# EAGLE design RasPi-powerSys (EAGLE 8.4.0)
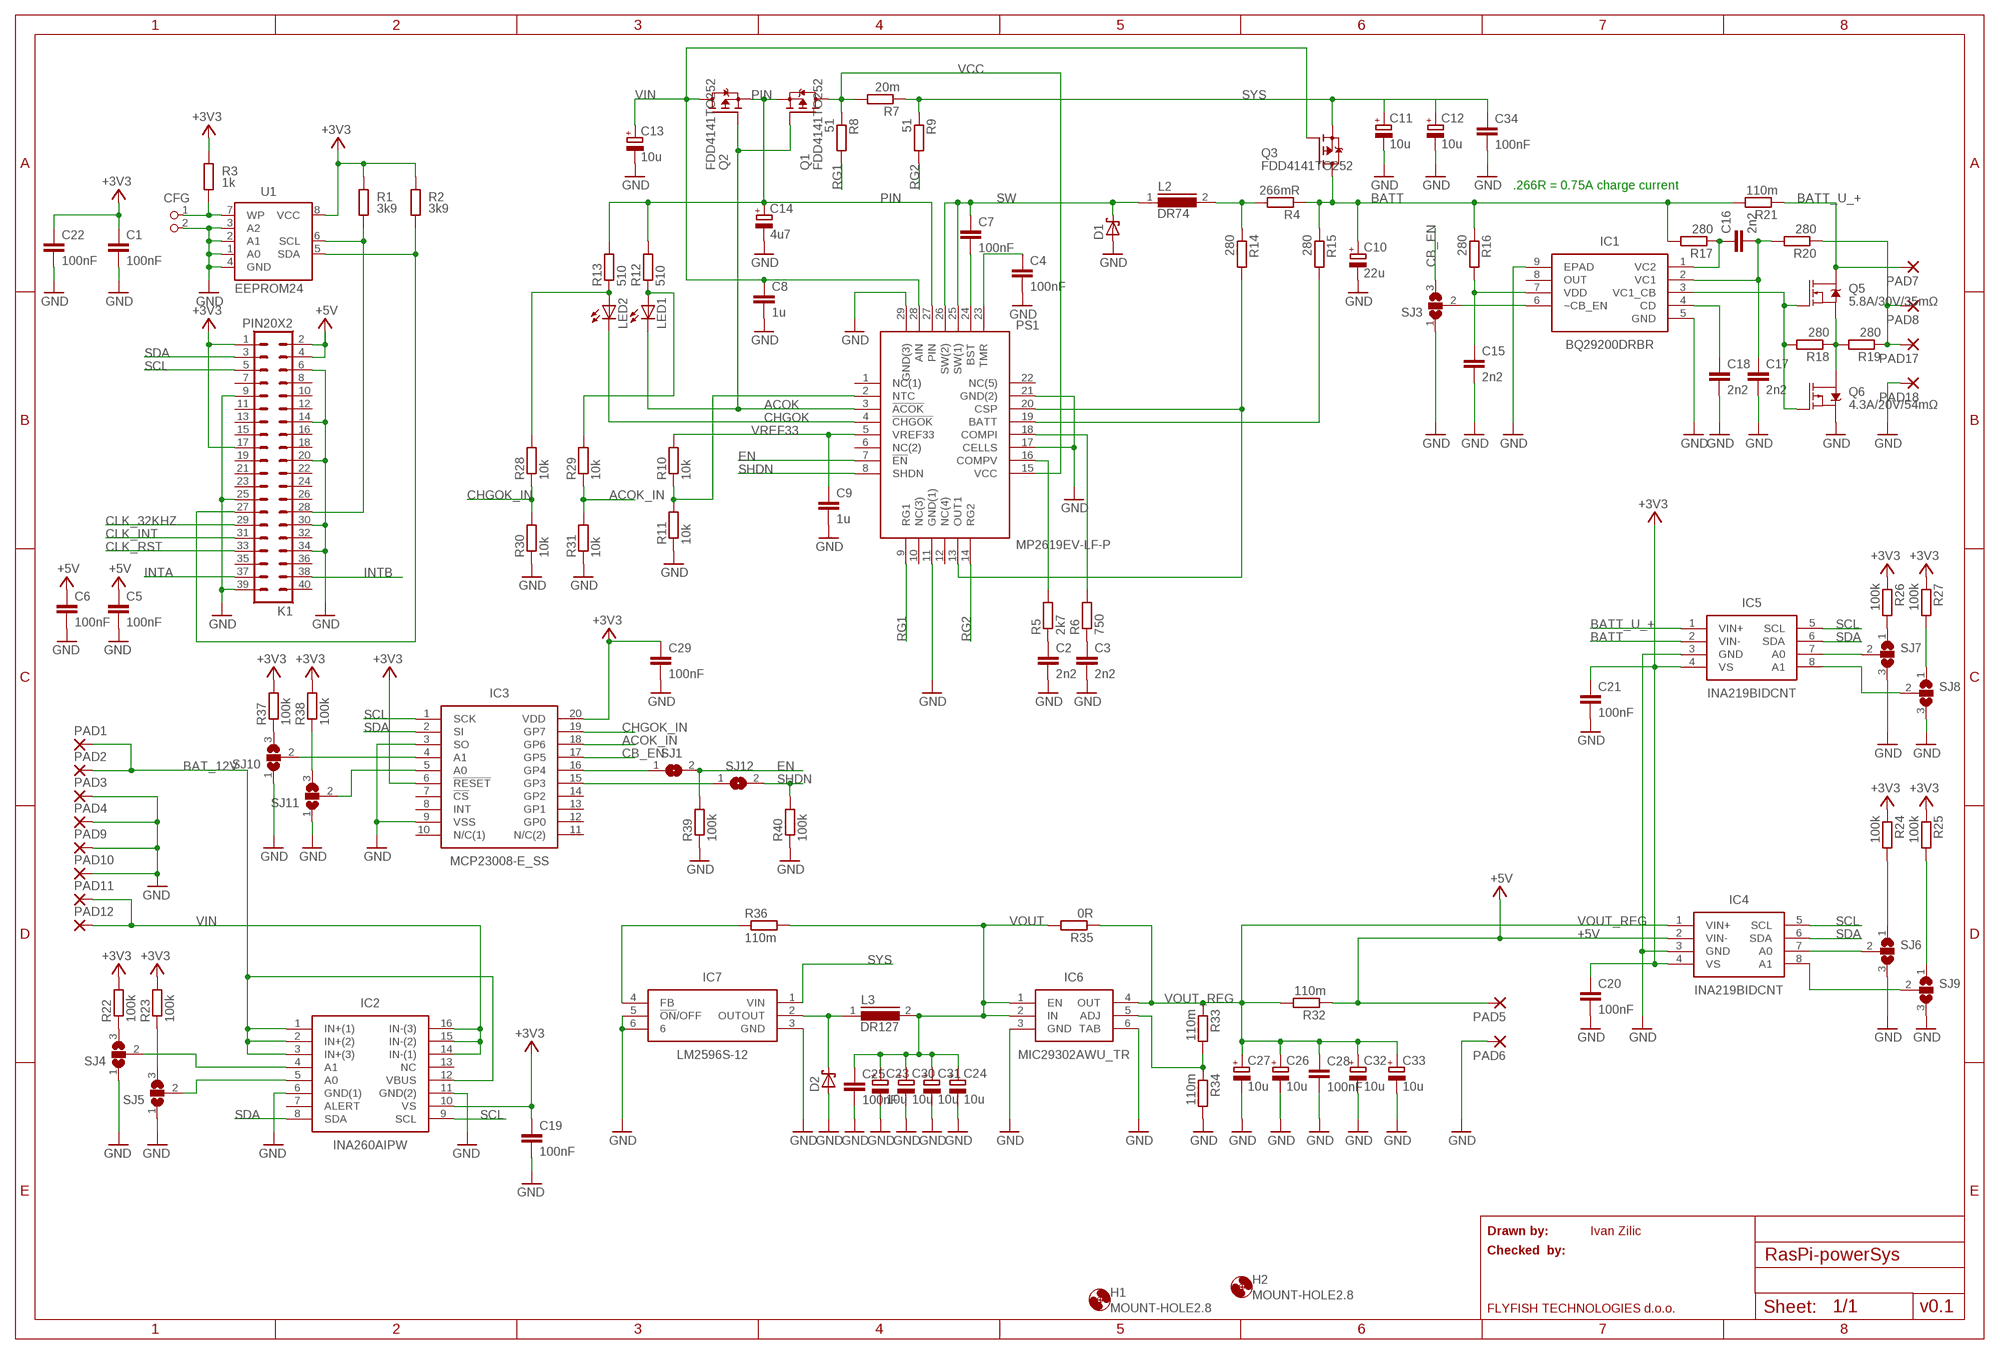
[diagram p0: schematic, sheet 1]

## Parts
C1  100nF  C-EUC0805K  [C0805K]
C2  2n2  C-EUC0805K  [C0805K]
C3  2n2  C-EUC0805K  [C0805K]
C4  100nF  C-EUC0805K  [C0805K]
C5  100nF  C-EUC0805K  [C0805K]
C6  100nF  C-EUC0805K  [C0805K]
C7  100nF  C-EUC0805K  [C0805K]
C8  1u  C-EUC0805K  [C0805K]
C9  1u  C-EUC0805K  [C0805K]
C10  22u  CPOL-EUSMCD  [SMC_D]
C11  10u  CPOL-EUSMCE  [SMC_E]
C12  10u  CPOL-EUSMCD  [SMC_D]
C13  10u  CPOL-EUSMCD  [SMC_D]
C14  4u7  CPOL-EUSMCD  [SMC_D]
C15  2n2  C-EUC0805K  [C0805K]
C16  2n2  C-EUC0805K  [C0805K]
C17  2n2  C-EUC0805K  [C0805K]
C18  2n2  C-EUC0805K  [C0805K]
C19  100nF  C-EUC0805K  [C0805K]
C20  100nF  C-EUC0805K  [C0805K]
C21  100nF  C-EUC0805K  [C0805K]
C22  100nF  C-EUC0805K  [C0805K]
C23  10u  CPOL-EUSMCE  [SMC_E]
C24  10u  CPOL-EUSMCE  [SMC_E]
C25  100nF  C-EUC0805K  [C0805K]
C26  10u  CPOL-EUSMCE  [SMC_E]
C27  10u  CPOL-EUSMCE  [SMC_E]
C28  100nF  C-EUC0805K  [C0805K]
C29  100nF  C-EUC0805K  [C0805K]
C30  10u  CPOL-EUSMCE  [SMC_E]
C31  10u  CPOL-EUSMCE  [SMC_E]
C32  10u  CPOL-EUSMCE  [SMC_E]
C33  10u  CPOL-EUSMCE  [SMC_E]
C34  100nF  C-EUC0805K  [C0805K]
CFG  PIN2_100  [PIN_W_2]
D1  SCHOTTKY-DIODESMD  [SMB]
D2  SCHOTTKY-DIODESMD  [SMB]
H1  MOUNT-HOLE2.8  [2,8]
H2  MOUNT-HOLE2.8  [2,8]
IC1  BQ29200DRBR  [SON65P300X300X100-9N]
IC2  INA260AIPW  [SOP65P640X120-16N]
IC3  MCP23008-E_SS  [SOP65P780X200-20N]
IC4  INA219BIDCNT  [SOT65P280X145-8N]
IC5  INA219BIDCNT  [SOT65P280X145-8N]
IC6  MIC29302AWU_TR  [5-PIN-TO-263(U)]
IC7  LM2596S-12  [5-PIN-TO-263(U)]
K1  PIN20X2  [PIN_20X2]
L2  DR74  [DR74]
L3  DR127  [DR127]
LED1  LEDCHIPLED_0805  [CHIPLED_0805]
LED2  LEDCHIPLED_0805  [CHIPLED_0805]
PAD1  3,81/1,4  [3,81/1,4]
PAD2  3,81/1,4  [3,81/1,4]
PAD3  3,81/1,4  [3,81/1,4]
PAD4  3,81/1,4  [3,81/1,4]
PAD5  3,81/1,4  [3,81/1,4]
PAD6  3,81/1,4  [3,81/1,4]
PAD7  3,81/1,4  [3,81/1,4]
PAD8  3,81/1,4  [3,81/1,4]
PAD9  3,81/1,4  [3,81/1,4]
PAD10  3,81/1,4  [3,81/1,4]
PAD11  3,81/1,4  [3,81/1,4]
PAD12  3,81/1,4  [3,81/1,4]
PAD17  3,81/1,4  [3,81/1,4]
PAD18  3,81/1,4  [3,81/1,4]
PS1  MP2619EV-LF-P  [QFN50P400X500X100-29N]
Q1  FDD4141TO252  [TO252]
Q2  FDD4141TO252  [TO252]
Q3  FDD4141TO252  [TO252]
Q5  5.8A/30V/35mΩ  MOSFET-NCH-AO3404A  [SOT23-3]
Q6  4.3A/20V/54mΩ  MOSFET_PCH-IRLML2244  [SOT23-3]
R1  3k9  R-EU_M0805  [M0805]
R2  3k9  R-EU_M0805  [M0805]
R3  1k  R-EU_M0805  [M0805]
R4  266mR  R-EU_R1206  [R1206]
R5  2k7  R-EU_R0805  [R0805]
R6  750  R-EU_R0805  [R0805]
R7  20m  R-EU_R0805  [R0805]
R8  51  R-EU_R0805  [R0805]
R9  51  R-EU_R0805  [R0805]
R10  10k  R-EU_R0805  [R0805]
R11  10k  R-EU_R0805  [R0805]
R12  510  R-EU_R0805  [R0805]
R13  510  R-EU_R0805  [R0805]
R14  280  R-EU_R0805  [R0805]
R15  280  R-EU_R0805  [R0805]
R16  280  R-EU_R0805  [R0805]
R17  280  R-EU_R1206  [R1206]
R18  280  R-EU_R1206  [R1206]
R19  280  R-EU_R1206  [R1206]
R20  280  R-EU_R1206  [R1206]
R21  110m  R-EU_R0805  [R0805]
R22  100k  R-EU_R0805  [R0805]
R23  100k  R-EU_R0805  [R0805]
R24  100k  R-EU_R0805  [R0805]
R25  100k  R-EU_R0805  [R0805]
R26  100k  R-EU_R0805  [R0805]
R27  100k  R-EU_R0805  [R0805]
R28  10k  R-EU_R0805  [R0805]
R29  10k  R-EU_R0805  [R0805]
R30  10k  R-EU_R0805  [R0805]
R31  10k  R-EU_R0805  [R0805]
R32  110m  R-EU_R1206  [R1206]
R33  110m  R-EU_R0805  [R0805]
R34  110m  R-EU_R0805  [R0805]
R35  0R  R-EU_R1206  [R1206]
R36  110m  R-EU_R0805  [R0805]
R37  100k  R-EU_R0805  [R0805]
R38  100k  R-EU_R0805  [R0805]
R39  100k  R-EU_R0805  [R0805]
R40  100k  R-EU_R0805  [R0805]
SJ1  SJ  [SJ]
SJ3  SJ2W  [SJ_2]
SJ4  SJ2W  [SJ_2]
SJ5  SJ2W  [SJ_2]
SJ6  SJ2W  [SJ_2]
SJ7  SJ2W  [SJ_2]
SJ8  SJ2W  [SJ_2]
SJ9  SJ2W  [SJ_2]
SJ10  SJ2W  [SJ_2]
SJ11  SJ2W  [SJ_2]
SJ12  SJ  [SJ]
U1  EEPROM24  [SOIC8]

## Nets
+3V3: C1.1 C19.1 C20.1 C21.1 C22.1 C29.1 IC2.10(VS) IC3.6(!RESET) IC3.20(VDD) IC4.4(VS) IC5.4(VS) K1.1 K1.17 R1.2 R2.2 R3.2 R22.2 R23.2 R24.1 R25.1 R26.1 R27.1 R37.2 R38.2 U1.8(VCC)
+5V: C5.1 C6.1 IC4.2(VIN-) K1.2 K1.4 PAD5.1(P) R32.1
ACOK: LED1.C PS1.3(!ACOK) Q1.1(G) Q2.1(G)
ACOK_IN: IC3.18(GP6) R29.1 R31.2
ADJ: IC6.5(ADJ) R33.2 R34.1
BAT_12V: IC2.1(IN+(1)) IC2.2(IN+(2)) IC2.3(IN+(3)) IC2.12(VBUS) PAD1.1(P) PAD2.1(P)
BATT: C10.+ IC5.2(VIN-) Q3.3(D) R4.1 R15.1 R16.1 R17.2 R21.2
BATT_U_+: IC5.1(VIN+) PAD7.1(P) Q5.3(D) R21.1
CB_EN: IC3.17(GP5) SJ3.3
CHGOK: LED2.C PS1.4(!CHGOK)
CHGOK_IN: IC3.19(GP7) R28.1 R30.2
CLK_32KHZ: K1.29
CLK_INT: K1.31
CLK_RST: K1.33
EN: PS1.7(!EN) R39.2 SJ1.2
GND: C1.2 C2.2 C3.2 C4.2 C5.2 C6.2 C8.2 C9.2 C10.- C11.- C12.- C13.- C14.- C15.2 C17.2 C18.2 C19.2 C20.2 C21.2 C22.2 C23.- C24.- C25.2 C26.- C27.- C28.2 C29.2 C30.- C31.- C32.- C33.- C34.2 CFG.2 D1.A D2.A IC1.5(GND) IC1.9(EPAD) IC2.6(GND(1)) IC2.11(GND(2)) IC3.3(SO) IC3.9(VSS) IC4.3(GND) IC5.3(GND) IC6.3(GND) IC6.6(TAB) IC7.3(GND) IC7.5(!ON!/OFF) IC7.6 K1.6 K1.9 K1.14 K1.20 K1.25 K1.30 K1.34 K1.39 PAD3.1(P) PAD4.1(P) PAD6.1(P) PAD9.1(P) PAD10.1(P) PAD18.1(P) PS1.11(GND(1)) PS1.17(CELLS) PS1.21(GND(2)) PS1.29(GND(3)) Q6.2(S) R11.1 R30.1 R31.1 R34.2 R39.1 R40.1 SJ3.1 SJ4.1 SJ5.1 SJ6.3 SJ7.3 SJ8.3 SJ9.3 SJ10.1 SJ11.1 U1.1(A0) U1.2(A1) U1.3(A2) U1.4(GND)
INTA: K1.37
INTB: K1.38
N$1: PS1.16(COMPV) R5.2
N$2: PS1.18(COMPI) R6.2
N$3: CFG.1 R3.1 U1.7(WP)
N$4: C2.1 R5.1
N$5: C3.1 R6.1
N$6: C4.1 PS1.23(TMR)
N$7: IC3.16(GP4) SJ1.1
N$8: C15.1 IC1.7(VDD) R16.2
N$9: C7.2 PS1.24(BST)
N$10: L2.2 R4.2 R14.1
N$11: IC1.6(~CB_EN) SJ3.2
N$12: PS1.2(NTC) R10.1 R11.2
N$13: Q5.2(S) Q6.3(D) R18.1 R19.2
N$14: IC3.15(GP3) SJ12.1
N$15: PS1.19(BATT) R15.2
N$16: LED1.A R12.1 R29.2
N$17: K1.28 R1.1 U1.6(SCL)
N$18: LED2.A R13.1 R28.2
N$19: C18.1 IC1.4(CD)
N$20: PS1.13(OUT1) PS1.20(CSP) R14.2
N$21: PAD8.1(P) PAD17.1(P) R19.1 R20.1
N$22: C16.2 C17.1 IC1.2(VC1) R20.2
N$23: K1.27 R2.1 U1.5(SDA)
N$24: C16.1 IC1.1(VC2) R17.1
N$25: IC1.3(VC1_CB) Q5.1(G) Q6.1(G) R18.2
N$26: IC2.5(A0) SJ5.2
N$27: IC2.4(A1) SJ4.2
N$28: R22.1 SJ4.3
N$29: R23.1 SJ5.3
N$30: R26.2 SJ7.1
N$31: R27.2 SJ8.1
N$32: IC4.8(A1) SJ9.2
N$33: IC4.7(A0) SJ6.2
N$34: IC5.8(A1) SJ8.2
N$35: IC5.7(A0) SJ7.2
N$36: R37.1 SJ10.3
N$37: D2.C IC7.2(OUTOUT) L3.1
N$38: R24.2 SJ6.1
N$39: R25.2 SJ9.1
N$41: IC7.4(FB) R36.1
N$42: IC3.4(A1) SJ10.2
N$43: IC3.5(A0) SJ11.2
N$44: R38.1 SJ11.3
PIN: C14.+ PS1.27(PIN) Q1.2(S) Q2.2(S) R12.2 R13.2
RG1: PS1.9(RG1) R8.2
RG2: PS1.14(RG2) R9.2
SCL: IC2.9(SCL) IC3.1(SCK) IC4.5(SCL) IC5.5(SCL) K1.5
SDA: IC2.8(SDA) IC3.2(SI) IC4.6(SDA) IC5.6(SDA) K1.3
SHDN: PS1.8(SHDN) R40.2 SJ12.2
SW: C7.1 D1.C L2.1 PS1.25(SW(1)) PS1.26(SW(2))
SYS: C11.+ C12.+ C34.1 IC7.1(VIN) Q3.2(S) R7.1 R9.1
VCC: PS1.15(VCC) Q1.3(D) R7.2 R8.1
VIN: C8.1 C13.+ IC2.14(IN-(1)) IC2.15(IN-(2)) IC2.16(IN-(3)) PAD11.1(P) PAD12.1(P) PS1.28(AIN) Q2.3(D) Q3.1(G)
VOUT: C23.+ C24.+ C25.1 C30.+ C31.+ IC6.1(EN) IC6.2(IN) L3.2 R35.2 R36.2
VOUT_REG: C26.+ C27.+ C28.1 C32.+ C33.+ IC4.1(VIN+) IC6.4(OUT) R32.2 R33.1 R35.1
VREF33: C9.1 PS1.5(VREF33) R10.2
Unconnected: IC1.8(OUT) IC2.7(ALERT) IC2.13(NC) IC3.7(!CS) IC3.8(INT) IC3.10(N/C(1)) IC3.11(N/C(2)) IC3.12(GP0) IC3.13(GP1) IC3.14(GP2) K1.7 K1.8 K1.10 K1.11 K1.12 K1.13 K1.15 K1.16 K1.18 K1.19 K1.21 K1.22 K1.23 K1.24 K1.26 K1.32 K1.35 K1.36 K1.40 PS1.1(NC(1)) PS1.6(NC(2)) PS1.10(NC(3)) PS1.12(NC(4)) PS1.22(NC(5))

## Notes on the sheet
- .266R = 0.75A charge current
- Drawn by: | Ivan Zilic
- Checked  by:
- FLYFISH TECHNOLOGIES d.o.o. | v0.1

## Library data of the parts
C1-C9 C15-C22 C25 C28 C29 C34 = resistor:C-EU: CAPACITOR, European symbol; DIELECTRIC: X7R
C10-C14 C23 C24 C26 C27 C30-C33 = rcl:CPOL-EU: POLARIZED CAPACITOR, European symbol
CFG = FLYFISH:PIN2
D1 D2 = diode:SCHOTTKY-DIODE: Schottky Diode
H1 H2 = holes:MOUNT-HOLE: MOUNTING HOLE with drill center marker
IC1 = SamacSys_Parts:BQ29200DRBR: Voltage Protection with Automatic Cell Balance For 2-Cell Li-Ion Batteries, OVP=4.35V <https://componentsearchengine.com/Images/1/BQ29200DRBR.jpg> Source: Datasheet <http://www.ti.com/lit/gpn/bq29200>; DESCRIPTION: Voltage Protection with Automatic Cell Balance For 2-Cell Li-Ion Batteries, OVP=4.35V; HEIGHT: mm; MANUFACTURER_NAME: Texas Instruments; MANUFACTURER_PART_NUMBER: BQ29200DRBR; SUPPLIER_NAME: RS
IC2 = SamacSys_Parts:INA260AIPW: High/Low-Side Digital Current/Power Monitor with Integrated 2m Shunt Resistor <https://componentsearchengine.com/Images/1/INA260AIPW.jpg> Source: Datasheet <http://www.ti.com/lit/gpn/ina260>; DESCRIPTION: High/Low-Side Digital Current/Power Monitor with Integrated 2m Shunt Resistor; HEIGHT: 1.2mm; MANUFACTURER_NAME: Texas Instruments; MANUFACTURER_PART_NUMBER: INA260AIPW; SUPPLIER_NAME: RS
IC3 = SamacSys_Parts:MCP23008-E_SS: 8-Bit I/O Port Expander I2C 1.7M SSOP20 Microchip MCP23008-E/SS, 8-channel 8bit I/O Expander 1.7MHz, I2C, 20-Pin SSOP <https://componentsearchengine.com/Images/3/MCP23008-E_SS.jpg> Source: Datasheet <http://docs-europe.electrocomponents.com/webdocs/137e/0900766b8137eeb7.pdf>; DESCRIPTION: 8-Bit I/O Port Expander I2C 1.7M SSOP20 Microchip MCP23008-E/SS, 8-channel 8bit I/O Expander 1.7MHz, I2C, 20-Pin SSOP; HEIGHT: 2mm; MANUFACTURER_NAME: Microchip; MANUFACTURER_PART_NUMBER: MCP23008-E/SS; RS_PART_NUMBER: 7709707; SUPPLIER_NAME: RS
IC4 IC5 = SamacSys_Parts:INA219BIDCNT: INA219BIDCNT, Intelligent Power Switch High Side Current Shunt, Power Monitor, 0.01A, 5.5V, 8-Pin, SOT-23 <https://componentsearchengine.com/Images/3/INA219BIDCNT.jpg> Source: Datasheet <http://www.ti.com/lit/ds/symlink/ina219.pdf>; DESCRIPTION: INA219BIDCNT, Intelligent Power Switch High Side Current Shunt, Power Monitor, 0.01A, 5.5V, 8-Pin, SOT-23; HEIGHT: 1.45mm; MANUFACTURER_NAME: Texas Instruments; MANUFACTURER_PART_NUMBER: INA219BIDCNT; RS_PART_NUMBER: 7300556P; SUPPLIER_NAME: RS
IC6 = SamacSys_Parts:MIC29302AWU_TR: LDO Reg Adj 1.24-15V 3A 6-Pin TO-263 Micrel MIC29302AWU TR, LDO Voltage Regulator, Adjustable 3A, 1.25 15 V 2%, 5-Pin TO-263 <https://componentsearchengine.com/Images/3/MIC29302AWU+TR.jpg> Source: Datasheet <http://uk.rs-online.com/web/p/products/8855990>; DESCRIPTION: LDO Reg Adj 1.24-15V 3A 6-Pin TO-263 Micrel MIC29302AWU TR, LDO Voltage Regulator, Adjustable 3A, 1.25 15 V 2%, 5-Pin TO-263; HEIGHT: mm; MANUFACTURER_NAME: Micrel; MANUFACTURER_PART_NUMBER: MIC29302AWU TR; RS_PART_NUMBER: 8855990; SUPPLIER_NAME: RS
IC7 = SamacSys_Parts:LM2596S-12: Step-down switching regulator,LM2596S-12 <https://componentsearchengine.com/Images/9/LM2596S-12.jpg> Source: Datasheet <http://www.ti.com/lit/ds/symlink/lm2596.pdf>
K1 = FLYFISH:PIN20X2
L2 = inductors:DR74: High Power Density, High Efficiency, Shielded Inductors Source: coiltronics_dr_series.pdf
L3 = inductors:DR127: High Power Density, High Efficiency, Shielded Inductors Source: coiltronics_dr_series.pdf
LED1 LED2 = led:LED: LED OSRAM: - CHIPLED LG R971, LG N971, LY N971, LG Q971, LY Q971, LO R971, LY R971 LH N974, LH R974 LS Q976, LO Q976, LY Q976 LO Q996 - Hyper CHIPLED LW Q18S LB Q993, LB Q99A, LB R99A - SideLED LS A670, LO A670, LY A670, LG A670, LP A670 LB A673, LV A673, LT A673, LW A673 LH A674 LY A675 LS A676, LA A676, LO A676, LY A676, LW A676 LS A679, LY A679, LG A679 - Hyper Micro SIDELED® LS Y876, LA Y876, LO Y876, LY Y876 LT Y87S - SmartLED LW L88C, LW L88S LB L89C, LB L89S, LG L890 LS L89K, LO L89K, LY L89K LS L896, LA L896, LO L896, LY L896 - TOPLED LS T670, LO T670, LY T670, LG T670, LP T670 LSG T670, LSP T670, LSY T670, LOP T670, LYG T670 LG T671, LOG T671, LSG T671 LB T673, LV T673, LT T673, LW T673 LH T674 LS T676, LA T676, LO T676, LY T676, LB T676, LH T676, LSB T676, LW T676 LB T67C, LV T67C, LT T67C, LS T67K, LO T67K, LY T67K, LW E67C LS E67B, LA E67B, LO E67B, LY E67B, LB E67C, LV E67C, LT E67C LW T67C LS T679, LY T679, LG T679 LS T770, LO T770, LY T770, LG T770, LP T770 LB T773, LV T773, LT T773, LW T773 LH T774 LS E675, LA E675, LY E675, LS T675 LS T776, LA T776, LO T776, LY T776, LB T776 LHGB T686 LT T68C, LB T68C - Hyper Mini TOPLED® LB M676 - Mini TOPLED Santana® LG M470 LS M47K, LO M47K, LY M47K Source: http://www.osram.convergy.de LUXEON: - LUMILED® LXK2-PW12-R00, LXK2-PW12-S00, LXK2-PW14-U00, LXK2-PW14-V00 LXK2-PM12-R00, LXK2-PM12-S00, LXK2-PM14-U00 LXK2-PE12-Q00, LXK2-PE12-R00, LXK2-PE12-S00, LXK2-PE14-T00, LXK2-PE14-U00 LXK2-PB12-K00, LXK2-PB12-L00, LXK2-PB12-M00, LXK2-PB14-N00, LXK2-PB14-P00, LXK2-PB14-Q00 LXK2-PR12-L00, LXK2-PR12-M00, LXK2-PR14-Q00, LXK2-PR14-R00 LXK2-PD12-Q00, LXK2-PD12-R00, LXK2-PD12-S00 LXK2-PH12-R00, LXK2-PH12-S00 LXK2-PL12-P00, LXK2-PL12-Q00, LXK2-PL12-R00 Source: www.luxeon.com KINGBRIGHT: KA-3528ASYC Source: www.kingbright.com
PAD1-PAD12 PAD17 PAD18 = wirepad:3,81/1,4: THROUGH-HOLE PAD
PS1 = SamacSys_Parts:MP2619EV-LF-P: Battery Management 2A,24V Switching Li-lon Charger With Power Path Management <https://componentsearchengine.com/Images/9/MP2619EV-LF-P.jpg> Source: Datasheet <https://componentsearchengine.com/Datasheets/1/MP2619EV-LF-P.pdf>; DESCRIPTION: Battery Management 2A,24V Switching Li-lon Charger With Power Path Management; HEIGHT: 1mm; MANUFACTURER_NAME: Monolithic Power Systems (MPS); MANUFACTURER_PART_NUMBER: MP2619EV-LF-P; SUPPLIER_NAME: RS
Q1-Q3 = transistor-fet:FDD4141: P-Channel PowerTrench® MOSFET Source: FDD4141.pdf
Q5 = SparkFun-DiscreteSemi:MOSFET-NCH: N-channel MOSFETs Voltage controlled devices that allow control of high current outputs. SparkFun Products: SparkFun OpenScale <https://www.sparkfun.com/products/13261> SparkFun Digital Sandbox <https://www.sparkfun.com/products/12651> SparkFun Monster Moto Shield <https://www.sparkfun.com/products/10182> SparkFun MOSFET Power Controller <https://www.sparkfun.com/products/11214>; PROD_ID: TRANS-12988
Q6 = SparkFun-DiscreteSemi:MOSFET_PCH: P-channel MOSFETs Voltage controlled devices that allow control of high current outputs. SparkFun Products: SparkFun ESP32 Thing <https://www.sparkfun.com/products/13907> SparkFun ESP8266 Thing <https://www.sparkfun.com/products/13231>; PROD_ID: TRANS-11153
R1-R3 = resistor:R-EU_: RESISTOR, European symbol; TOLERANCE: 5%
R4-R40 = rcl:R-EU_: RESISTOR, European symbol
SJ1 SJ12 = jumper:SJ: SMD solder JUMPER
SJ3-SJ11 = jumper:SJ2W: SMD solder JUMPER
U1 = FLYFISH:EEPROM24

## Board
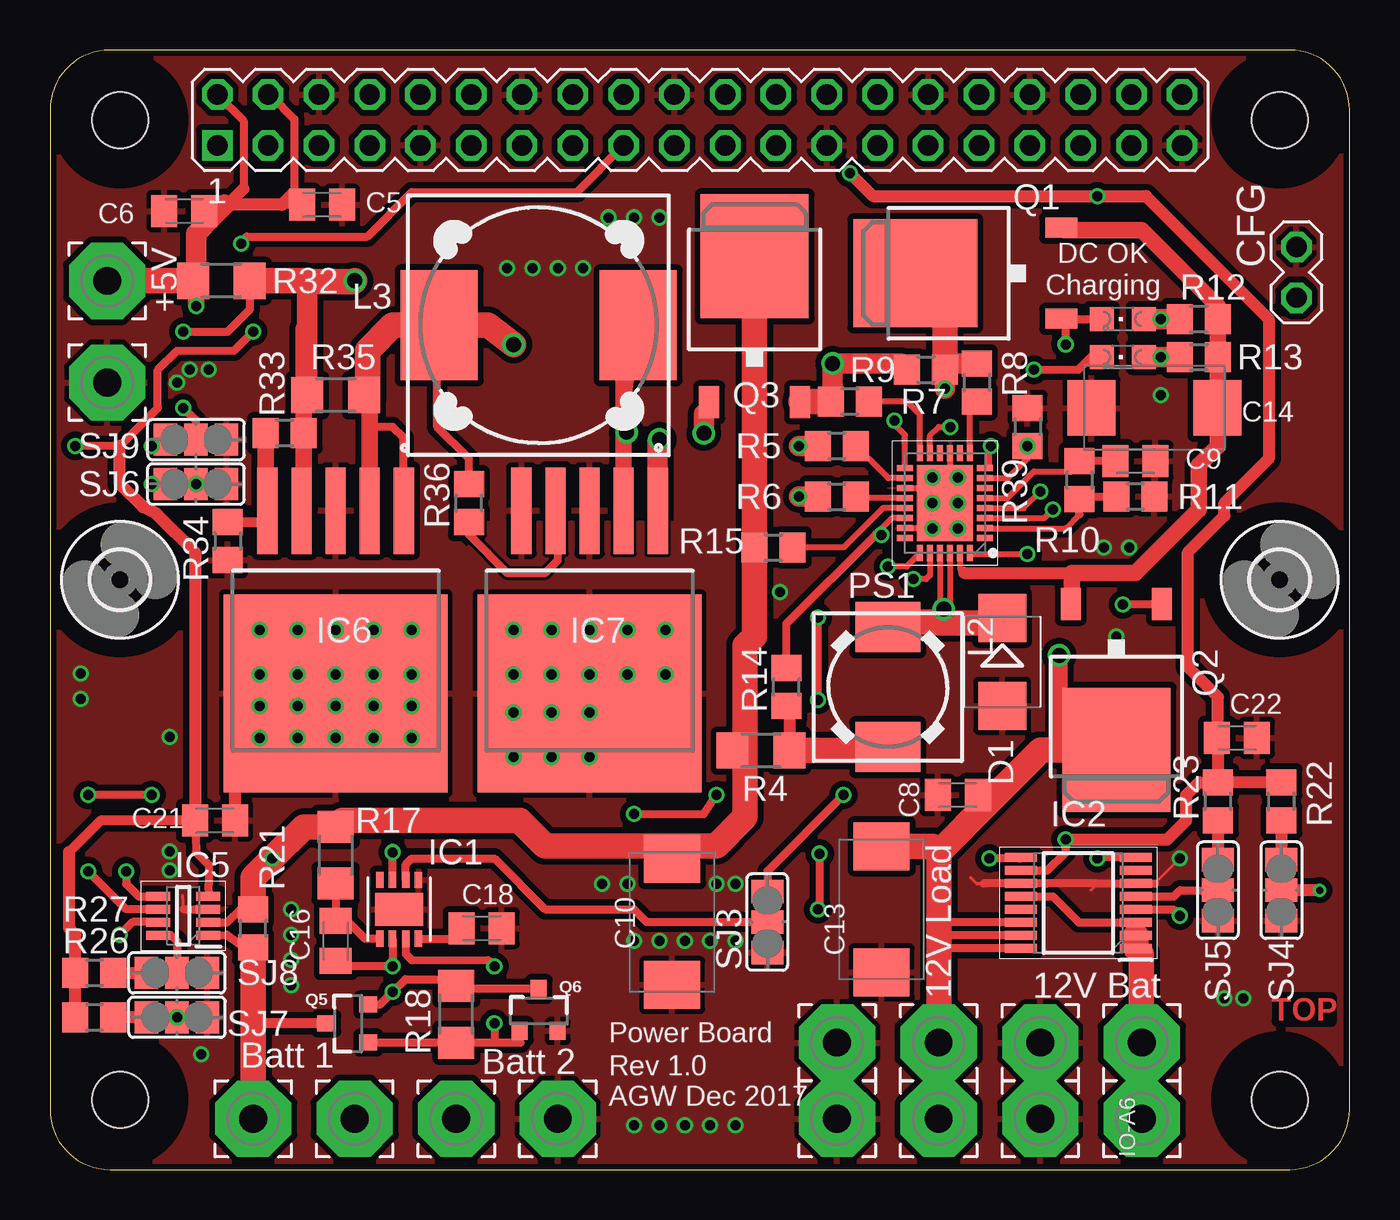
[diagram p1: board, top side]
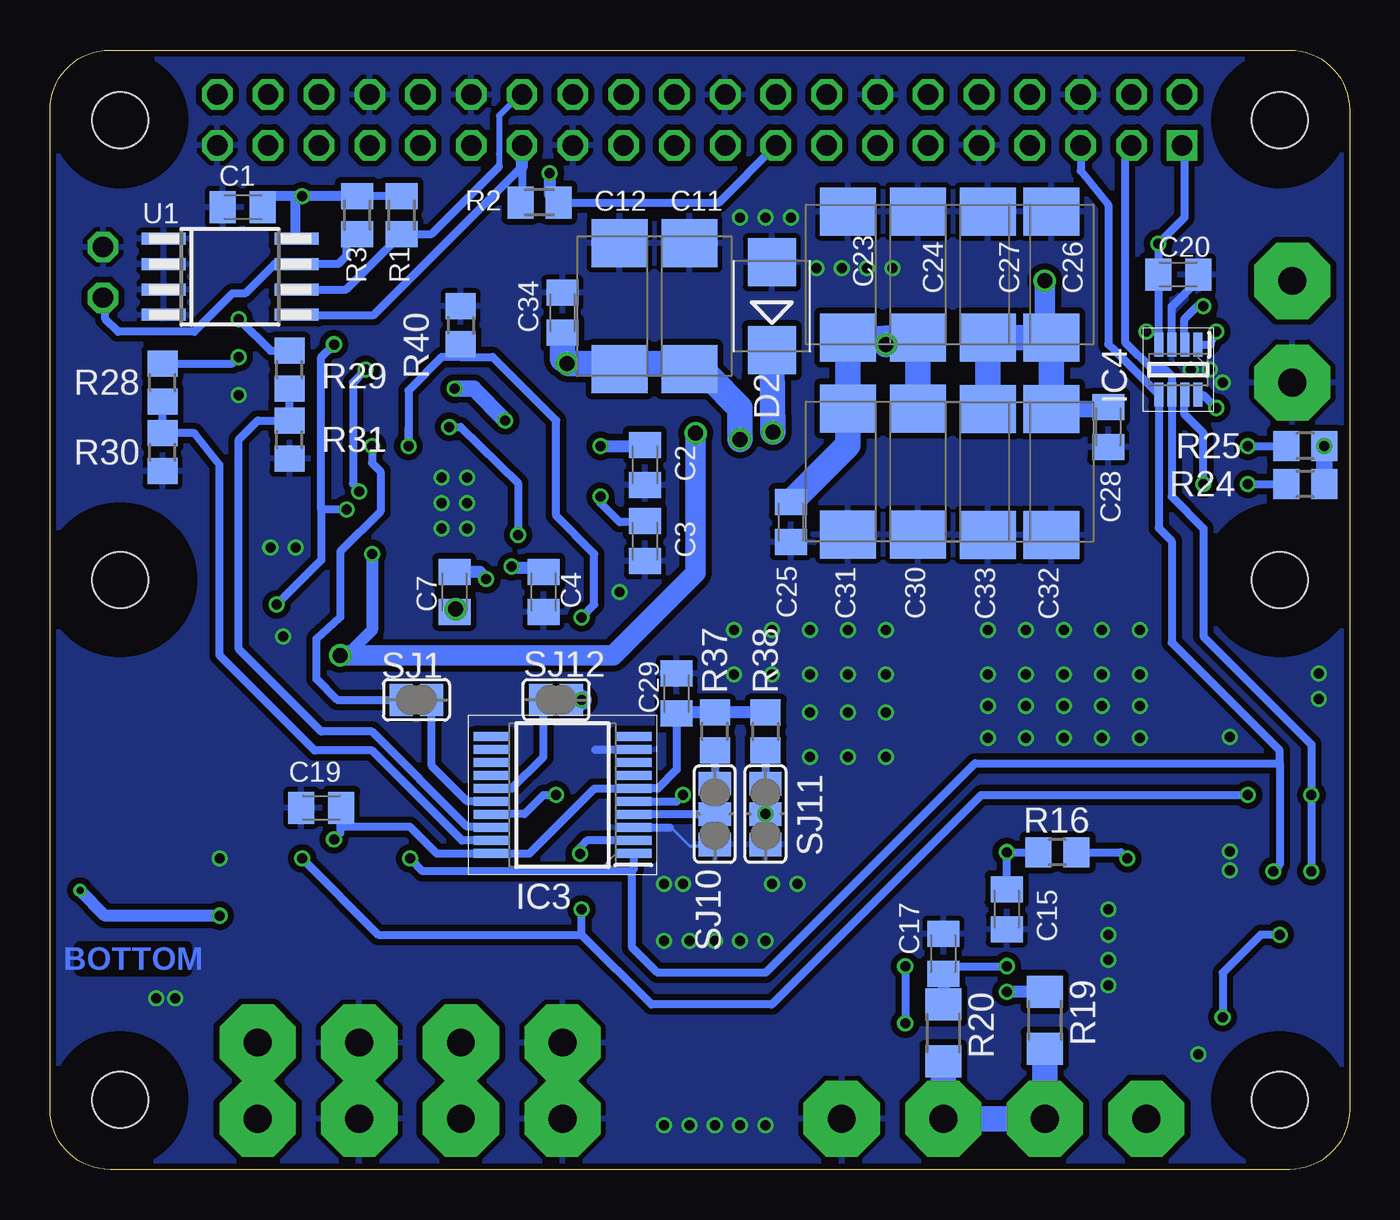
[diagram p2: board, bottom side, seen from below]

Size 65 x 56 mm. Coordinates in mm from the lower left corner, seen from the top.
Outline: 0,3 arc90 3,0 62,0 arc90 65,3 65,53 arc90 62,56 3,56 arc90 0,53 0,3
Copper layers (1*16): Top 0.035mm / dielectric 1.5mm / Bottom 0.035mm
Design rules "ITEADstudio_DRC": minimum track width 6mil, minimum drill 12mil, track to track 6mil, track to pad 6mil, pad to pad 6mil, via to via 6mil, smd to smd 0mil, copper to edge 10mil, drill to drill 10mil, minimum pad ring 10mil, minimum via ring 6mil, stop-mask expansion 2mil, vias tented up to drill 100mil, thermal gap 10mil
Holes 2.8 mm at 3.5,3.5 3.5,52.5 61.5,52.5 61.5,3.5
tRestrict: area 1.9,51 to 5,54; area 60,51 to 63,54; area 60,1.9 to 63,5; area 1.9,1.9 to 5,5
bRestrict: area 1.9,1.9 to 5,5; area 1.9,51 to 5,54; area 60,1.9 to 63,5; area 60,51 to 63,54

### Footprints (pad centres in the part's own frame; a part is rotated, then mirrored left to right if it is on the bottom)
C0805K = smd 1.3 x 1.6: 1 -1,0; 2 1,0
SMC_D = smd 2.4 x 2.8: + -3.15,0; - 3.15,0
SMC_E = smd 2.4 x 2.8: + -3.15,0; - 3.15,0
PIN_W_2 = drill 1.016 octagon: 1 0,0; 2 0,-2.54
SMB = smd 2.4 x 2.4: A 2.2,0; C -2.2,0
2,8 = hole 2.8: 0,0
SON65P300X300X100-9N = smd 0.813 x 0.381: 1 -1.473,0.965; 2 -1.473,0.33; 3 -1.473,-0.33; 4 -1.473,-0.965; 5 1.473,-0.965; 6 1.473,-0.33; 7 1.473,0.33; 8 1.473,0.965 | smd 1.651 x 2.388: 9 0,0
SOP65P640X120-16N = smd 1.6 x 0.45: 1 -2.875,2.275; 2 -2.875,1.625; 3 -2.875,0.975; 4 -2.875,0.325; 5 -2.875,-0.325; 6 -2.875,-0.975; 7 -2.875,-1.625; 8 -2.875,-2.275; 9 2.875,-2.275; 10 2.875,-1.625; 11 2.875,-0.975; 12 2.875,-0.325; 13 2.875,0.325; 14 2.875,0.975; 15 2.875,1.625; 16 2.875,2.275
SOP65P780X200-20N = smd 1.8 x 0.45: 1 -3.55,2.925; 2 -3.55,2.275; 3 -3.55,1.625; 4 -3.55,0.975; 5 -3.55,0.325; 6 -3.55,-0.325; 7 -3.55,-0.975; 8 -3.55,-1.625; 9 -3.55,-2.275; 10 -3.55,-2.925; 11 3.55,-2.925; 12 3.55,-2.275; 13 3.55,-1.625; 14 3.55,-0.975; 15 3.55,-0.325; 16 3.55,0.325; 17 3.55,0.975; 18 3.55,1.625; 19 3.55,2.275; 20 3.55,2.925
SOT65P280X145-8N = smd 1.2 x 0.45: 1 -1.25,0.975; 2 -1.25,0.325; 3 -1.25,-0.325; 4 -1.25,-0.975; 5 1.25,-0.975; 6 1.25,-0.325; 7 1.25,0.325; 8 1.25,0.975
5-PIN-TO-263(U) = smd 1.02 x 4.32: 1 -3.404,-12; 2 -1.702,-12; 3 0,-12; 4 1.702,-12; 5 3.404,-12 | smd 11.18 x 9.91: 6 0,-2.855
PIN_20X2 = drill 1.016 square: 1 -24.13,-1.27 | drill 1.016 octagon: 2 -24.13,1.27; 3 -21.59,-1.27; 4 -21.59,1.27; 5 -19.05,-1.27; 6 -19.05,1.27; 7 -16.51,-1.27; 8 -16.51,1.27; 9 -13.97,-1.27; 10 -13.97,1.27; 11 -11.43,-1.27; 12 -11.43,1.27; 13 -8.89,-1.27; 14 -8.89,1.27; 15 -6.35,-1.27; 16 -6.35,1.27; 17 -3.81,-1.27; 18 -3.81,1.27; 19 -1.27,-1.27; 20 -1.27,1.27; 21 1.27,-1.27; 22 1.27,1.27; 23 3.81,-1.27; 24 3.81,1.27; 25 6.35,-1.27; 26 6.35,1.27; 27 8.89,-1.27; 28 8.89,1.27; 29 11.43,-1.27; 30 11.43,1.27; 31 13.97,-1.27; 32 13.97,1.27; 33 16.51,-1.27; 34 16.51,1.27; 35 19.05,-1.27; 36 19.05,1.27; 37 21.59,-1.27; 38 21.59,1.27; 39 24.13,-1.27; 40 24.13,1.27
DR74 = smd 2.5 x 3.25: 1 -3,0; 2 3,0
DR127 = smd 3.85 x 5.5: 1 -4.975,0; 2 4.975,0
CHIPLED_0805 = smd 1.2 x 1.2: A 0,-1.05; C 0,1.05
3,81/1,4 = drill 1.397 pad 3.81 octagon: 1 0,0
QFN50P400X500X100-29N = smd 0.8 x 0.3: 1 -2,1.75; 2 -2,1.25; 3 -2,0.75; 4 -2,0.25; 5 -2,-0.25; 6 -2,-0.75; 7 -2,-1.25; 8 -2,-1.75; 15 2,-1.75; 16 2,-1.25; 17 2,-0.75; 18 2,-0.25; 19 2,0.25; 20 2,0.75; 21 2,1.25; 22 2,1.75 | smd 0.3 x 0.8: 9 -1.25,-2.5; 10 -0.75,-2.5; 11 -0.25,-2.5; 12 0.25,-2.5; 13 0.75,-2.5; 14 1.25,-2.5; 23 1.25,2.5; 24 0.75,2.5; 25 0.25,2.5; 26 -0.25,2.5; 27 -0.75,2.5; 28 -1.25,2.5 | smd 2.8 x 3.8: 29 0,0
TO252 = smd 1 x 1.6: 1 -2.28,-4.8; 2 2.28,-4.8 | smd 5.4 x 6.2: 3 0,2.5
SOT23-3 = smd 0.8 x 0.9: 1 -0.95,-1; 2 0.95,-1; 3 0,1.1
M0805 = smd 1.3 x 1.6: 1 -0.95,0; 2 0.95,0
R1206 = smd 1.6 x 1.803: 1 -1.422,0; 2 1.422,0
R0805 = smd 1.3 x 1.5: 1 -0.95,0; 2 0.95,0
SJ = smd 1.168 x 1.6: 1 -0.762,0; 2 0.762,0
SJ_2 = smd 1.168 x 1.6: 1 -1.524,0; 2 0,0; 3 1.524,0
SOIC8 = smd 0.6 x 2.2: 1 -1.905,-3.33; 2 -0.635,-3.33; 3 0.635,-3.33; 4 1.905,-3.33; 5 1.905,3.33; 6 0.635,3.33; 7 -0.635,3.33; 8 -1.905,3.33

### Placement (x,y rotation side)
C1  55.36,48.15 180 bottom
C2  35.24,35.24 270 bottom
C3  35.24,31.43 270 bottom
C4  40.32,28.89 270 bottom
C5  13.61,48.26 0 top
C6  6.71,47.94 180 top
C7  44.77,28.89 90 bottom
C8  45.4,18.73 180 top
C9  54.29,35.43 0 top
C10  31.11,12.38 270 top
C11  33.02,43.18 90 bottom
C12  36.51,43.18 90 bottom
C13  41.59,13.02 270 top
C14  55.24,38.1 180 top
C15  17.14,13.02 270 bottom
C16  14.29,11.43 270 top
C17  20.32,10.79 90 bottom
C18  21.59,12.06 0 top
C19  51.44,18.1 180 bottom
C20  8.57,44.77 0 bottom
C21  8.26,17.46 0 top
C22  59.37,21.59 0 top
C23  25.08,44.77 90 bottom
C24  21.59,44.77 90 bottom
C25  27.94,32.38 270 bottom
C26  14.92,44.77 90 bottom
C27  18.1,44.77 90 bottom
C28  12.06,37.15 270 bottom
C29  33.66,23.81 90 bottom
C30  21.59,34.92 270 bottom
C31  25.08,34.92 270 bottom
C32  14.92,34.9 270 bottom
C33  18.1,34.9 270 bottom
C34  39.37,42.86 90 bottom
CFG  62.34,43.61 180 top
D1  47.62,25.4 270 top
D2  28.89,43.18 90 bottom
H1  3.5,29.5 0 top
H2  61.5,29.5 0 top
IC1  17.46,13.02 90 top
IC2  51.44,13.34 180 top
IC3  39.37,18.73 180 bottom
IC4  8.57,40.01 270 bottom
IC5  6.67,12.7 180 top
IC6  14.29,20.95 180 top
IC7  26.99,20.95 180 top
K1  32.5,52.5 0 top
L2  41.91,24.13 270 top
L3  24.45,42.23 180 top
LED1  53.66,42.55 90 top
LED2  53.66,40.64 90 top
PAD1  54.61,6.35 0 top
PAD2  54.61,2.54 0 top
PAD3  39.37,6.35 0 top
PAD4  39.37,2.54 0 top
PAD5  2.86,44.45 0 top
PAD6  2.86,39.37 0 top
PAD7  10.16,2.54 0 top
PAD8  15.24,2.54 0 top
PAD9  49.53,2.54 0 top
PAD10  49.53,6.35 0 top
PAD11  44.45,6.35 0 top
PAD12  44.45,2.54 0 top
PAD17  20.32,2.54 0 top
PAD18  25.4,2.54 0 top
PS1  44.77,33.34 180 top
Q1  45.78,44.83 90 top
Q2  53.34,23.5 180 top
Q3  35.24,43.18 0 top
Q5  14.92,7.3 90 top
Q6  24.45,7.94 0 top
R1  47.42,47.74 90 bottom
R2  40.52,48.37 0 bottom
R3  49.64,47.74 90 bottom
R4  35.56,20.95 0 top
R5  39.37,36.2 0 top
R6  39.37,33.66 0 top
R7  43.81,40.01 0 top
R8  46.35,39.37 270 top
R9  40.01,38.42 0 top
R10  51.5,34.48 90 top
R11  54.29,33.66 180 top
R12  57.47,42.55 0 top
R13  57.47,40.64 0 top
R14  36.83,24.13 90 top
R15  36.2,31.11 0 top
R16  14.61,15.88 180 bottom
R17  14.29,15.72 90 top
R18  20.32,7.77 270 top
R19  15.24,7.47 90 bottom
R20  20.32,6.83 90 bottom
R21  10.16,12.06 90 top
R22  61.59,18.41 90 top
R23  58.42,18.41 90 top
R24  2.22,34.29 180 bottom
R25  2.22,36.2 180 bottom
R26  2.22,7.62 0 top
R27  2.22,9.84 0 top
R28  59.37,39.37 90 bottom
R29  53.02,40.01 90 bottom
R30  59.37,35.88 90 bottom
R31  53.02,36.51 90 bottom
R32  8.57,44.45 0 top
R33  11.74,36.83 180 top
R34  8.89,31.43 270 top
R35  14.29,38.73 0 top
R36  20.95,33.34 90 top
R37  31.75,21.91 90 bottom
R38  29.21,21.91 90 bottom
R39  48.9,37.15 270 top
R40  44.45,42.23 270 bottom
SJ1  46.67,23.5 180 bottom
SJ3  35.88,12.38 90 top
SJ4  61.59,13.97 90 top
SJ5  58.42,13.97 90 top
SJ6  7.3,34.29 0 top
SJ7  6.35,7.62 0 top
SJ8  6.35,9.84 0 top
SJ9  7.3,36.51 0 top
SJ10  31.75,17.78 90 bottom
SJ11  29.21,17.78 90 bottom
SJ12  39.69,23.5 0 bottom
U1  55.99,44.66 270 bottom

### Tracks (layer width: path | path; a pad name or v marks a point on that pad's centre or on a via)
+3V3  (via drill 0.5)
  Top 0.152: 49.26,14.96 IC2.10 | R23.2 | C22.1 58.42,21.54 | 0.91,15.83 0.95,15.88 | v9.57,46.31 9.48,46.31
  Top 0.406: IC5.4 7.96,13.68 7.94,14.29 7.94,15.24 7.3,15.88 C21.1 | R25.1 3.49,36.2 5.4,38.1 5.4,40.01 6.35,40.96 9.21,40.96 v10.16,41.91 | IC2.10 49.88,14.96 50.8,15.88 v50.8,16.51 | 9.48,46.31 9.84,46.67 15.88,46.67 18.1,48.9 26.36,48.9 K1.17
  Top 0.508: C21.1 2.54,17.46 0.91,15.83
  Top 0.61: R22.2 R23.2 58.42,21.54 58.42,23.63 56.91,25.14 56.91,30.88 58.74,32.7 58.74,33.34 60.96,35.56 60.96,42.55 54.81,48.69 v52.39,48.69 41.16,48.69 v40.01,49.85 | v50.8,16.51 55.88,16.51 56.83,17.46 56.83,18.73 57.47,19.37 R23.2 | R26.1 R27.1 1.27,11.74 0.95,12.06 0.95,15.88 | 3.49,36.2 3.49,34.29 4.65,33.13 5.32,32.81 7.25,30.88 C21.1
  Bottom 0.152: 54.36,47.88 C1.1 53.82,48.69 | 9.57,41.23 IC4.4 | C20.1 9.55,44.74 | K1.1 8.26,51.12 | 40.01,48.8 R2.2 | 50.44,17.14 C19.1 | 33.61,22.86 C29.1 | U1.8 52.7,46.6
  Bottom 0.406: R1.2 49.85,48.69 | R2.2 31.55,48.37 K1.17 | 9.55,41.91 IC4.4 | 9.55,41.91 9.55,44.74 | 8.26,51.12 8.26,47.62 v9.57,46.31 C20.1 | C19.1 50.53,18.05 50.48,17.78 50.48,16.83 v50.8,16.51 | C29.1 33.66,20 34.6,19.06 IC3.6 37.77,19.06 41.02,15.81 IC3.20 45.65,15.81 46.99,17.14 50.44,17.14 | v10.16,41.91 9.55,41.91
  Bottom 0.508: R3.2 49.85,48.69 v52.39,48.69 52.7,48.69 | 52.7,48.69 53.82,48.69 | 52.7,46.6 52.7,48.69
  Bottom 0.61: v40.01,49.85 40.01,48.8 | R38.2 R37.2 33.61,22.86
  Bottom 0.813: R24.1 R25.1
  other vias: 1.27,36.2
+5V  (via drill 0.5)
  Top 0.152: K1.4 11,53.77 | R32.1 7.3,44.3 | 8.74,48.26 8.42,47.79 | 11.68,48.35 11.59,48.26 | C6.1 7.94,47.94 8.18,47.7
  Top 0.406: 9.68,49.05 9.68,52.46 K1.2 | 11,53.77 12.22,52.55 12.22,48.9
  Top 0.61: 9.68,49.05 8.42,47.79 | 12.22,48.9 11.59,48.26 8.74,48.26 | C5.1 11.68,48.35
  Top 0.813: v7.3,43.18 7.3,44.3
  Top 1.016: 8.74,48.26 8.18,47.7 7.3,46.83 7.3,44.45 R32.1 6.99,44.45
  Top 1.27: PAD5.1 7.3,44.45
  Bottom 0.152: IC4.2
  Bottom 0.406: IC4.2 8.26,42.55 7.62,43.18 v7.3,43.18
ACOK  (via drill 0.5)
  Top 0.152: Q1.1 50.8,42.55 | v53.66,28.26 53.7,28.3
  Top 0.305: PS1.3 49.73,32.59 v50.16,33.02
  Top 0.406: LED1.C 50.8,42.55 v50.8,41.27 | 53.7,28.3 Q2.1
  Bottom 0.406: v53.66,28.26 51.44,30.48 51.44,33.02 | 51.44,33.02 51.44,40.64 v50.8,41.27 | v50.16,33.02 51.44,33.02
ACOK_IN
  Bottom 0.152: R31.2 | IC3.18 42.96,17.14
  Bottom 0.406: R31.2 R29.1 | R31.2 54.61,37.47 55.56,36.51 55.56,26.04 51.44,21.91 48.9,21.91 44.13,17.14 42.96,17.14
ADJ
  Top 0.152: 10.85,33.31 10.79,34 | 10.85,33.31 IC6.5 | R34.1 | 10.79,32.38 10.85,32.12 10.85,33.31
  Top 0.508: R34.1 10.79,32.38
  Top 0.813: 10.79,34 R33.2
BAT_12V
  Top 0.152: IC2.1 54.59,10.78 54.61,10.76 | IC2.12 | PAD1.1 54.59,6.37
  Top 0.406: IC2.2 IC2.3 51.46,12.36 50.16,13.65 IC2.12
  Top 1.27: IC2.2 IC2.1 | 54.59,6.37 54.59,10.78
  Bottom 0.152: PAD1.1 PAD2.1
BATT  (via drill 0.5)
  Top 0.152: 8.88,12.38 | 9.53,13.02 R21.2 | Q3.3 | R17.2 14.61,17.46 | R4.1 34.46,20.95 34.77,20.64 | C10.+ 31.11,16.19 | 23.52,17.46 23.52,17.44 | R15.1
  Top 0.406: IC5.2 8.88,12.38 | 8.88,12.38 9.53,13.02
  Top 1.27: R17.2 12.7,17.14 v11.11,15.56 10.16,14.61 R21.2 | 14.61,17.46 23.52,17.46 | Q3.3 R15.1 35.24,29.21 35.24,26.67 34.77,26.2 34.77,20.64 34.77,17.63 33.34,16.19 31.11,16.19 24.77,16.19 23.52,17.44
  Bottom 0.406: R16.1 11.43,15.88 v11.11,15.56
BATT_U_+
  Top 0.152: 10.16,10.79 R21.1 | 10.31,7.3 10.16,7.45 10.16,7.62 10.16,7.79
  Top 0.406: IC5.1 8.85,11.75 10.16,10.79
  Top 0.508: Q5.3 10.31,7.3
  Top 1.27: 10.16,7.79 R21.1 | PAD7.1 10.16,7.62
CB_EN  (via drill 0.5)
  Top 0.406: v39.69,18.73 35.88,14.92 SJ3.3
  Bottom 0.152: 42.9,17.78 IC3.17
  Bottom 0.406: v39.69,18.73 40.32,18.73 41.27,17.78 42.9,17.78
CHGOK  (via drill 0.5)
  Top 0.152: 52.07,40.64 LED2.C
  Top 0.305: PS1.4 48.7,33.09 v49.53,33.92
  Top 0.406: v49.21,40.01 51.44,40.01 52.07,40.64
  Bottom 0.152: 49.53,33.97 v49.53,33.92
  Bottom 0.406: v49.21,40.01 49.85,39.37 49.85,34.29 49.53,33.97
CHGOK_IN
  Bottom 0.152: R30.2
  Bottom 0.406: R30.2 R28.1 | R30.2 57.78,36.83 56.52,35.24 56.52,25.72 51.75,20.95 48.9,20.95 44.4,16.46 IC3.19
CLK_32KHZ
  Top 0.152: K1.29 43.81,51.12
CLK_INT
  Top 0.152: K1.31 46.35,51.12
CLK_RST
  Top 0.152: K1.33 48.9,51.12
EN  (via drill 0.5)
  Top 0.152: R39.2
  Top 0.305: PS1.7 47.92,34.59 48.9,35.56 R39.2
  Bottom 0.406: SJ1.2 50.63,23.5 51.67,24.54 51.67,26.54 50.48,27.62 50.48,30.91 48.47,32.92 48.47,34.92 48.9,35.34 R39.2
  other vias: 48.9,36.2
GND  (via drill 0.5)
  Top 0.152: PS1.29 43.52,32.09 | 7.29,13.03 IC5.3 | 6.62,13.7 6.67,13.02 6.67,13.03 | C14.- 52.09,38.08 51.5,38.67 | 52.07,13.97 52.39,14.29 52.39,14.31 | 46.7,14.31 IC2.11 | 46.7,14.31 46.67,14.29 | 46.04,14.61 46.33,14.31 46.7,14.31 | 55.27,14.31 v56.52,15.56 | 44.25,34.09 45.02,34.86 45.15,34.86 v45.4,34.61 | 9.26,20.05 v10.48,21.59
  Top 0.305: PS1.21 43.52,32.09 | PS1.17 44.25,34.09 | PS1.11 45.02,34.86
  Top 0.406: 6.67,13.03 7.29,13.03 | IC2.11 52.39,14.31 IC2.6 55.27,14.31 | 49.85,14.31 46.7,14.31
  Top 0.61: C21.2 9.26,20.05
  Bottom 0.152: 8.9,43.17 8.89,43.18 | 7.57,44.5 C20.2 | 34.01,17.11 33.97,17.14 33.02,16.19 31.81,16.19 SJ10.1 | 35.86,20.95 35.86,20.97 IC3.9 | 37.73,21.01 37.78,20.95
  Bottom 0.406: IC4.3 8.9,43.17 7.57,44.5 | IC3.3 34.01,17.11 | 37.73,21.01 IC3.9
  other vias: 7.57,5.76 53.34,26.67 52.7,31.11 12.38,26.99 12.38,21.59 14.29,21.59 14.29,26.99 16.19,21.59 18.1,21.59 10.48,26.99 10.48,24.77 10.48,23.18 12.38,23.18 14.29,24.77 12.38,24.77 14.29,23.18 16.19,26.99 18.1,26.99 16.19,24.77 16.19,23.18 18.1,24.77 18.1,23.18 26.99,20.64 25.08,20.64 23.18,22.86 26.99,22.86 26.99,24.77 25.08,24.77 26.99,26.99 25.08,26.99 25.08,22.86 23.18,24.77 23.18,26.99 23.18,20.64 28.89,26.99 30.8,24.77 28.89,24.77 30.8,26.99 59.69,8.57 58.74,8.57 5.99,15.92 5.99,14.97 5.99,21.64 1.54,24.81 1.54,23.54 55.56,38.73 27.62,14.29 28.89,14.29 33.34,14.29 34.29,14.29 30.48,11.43 33.02,11.43 31.75,11.43 29.21,11.43 34.29,11.43 12.06,13.02 12.06,11.75 12.06,10.48 12.06,9.21 29.21,2.22 30.48,2.22 31.75,2.22 33.02,2.22 34.29,2.22 53.98,31.11 36.51,28.89 7.94,40.01 6.99,40.01 6.35,39.37 44.13,33.34 45.4,33.34 44.13,34.61 44.13,32.07 45.4,32.07 22.86,45.09 24.13,45.09 25.4,45.09 26.67,45.09 30.48,47.62 29.21,47.62 27.94,47.62
  pour Bottom (isolate 0.305): 0,3 arc90 3,0 62,0 arc90 65,3 65,53 arc90 62,56 3,56 arc90 0,53 0,18.5
  pour Top (isolate 0.305): 0,3 arc90 3,0 62,0 arc90 65,3 65,53 arc90 62,56 3,56 arc90 0,53 0,18.5
  pour Top: 21.27,32.38 32.7,32.38 32.7,21.91 20.95,21.91 20.95,32.38
INTB
  Bottom 0.152: K1.38 54.18,53.77
N$1
  Top 0.305: PS1.16 41.93,34.59 40.96,35.56 R5.2
N$2
  Top 0.152: 40.39,33.59 R6.2
  Top 0.305: PS1.18 40.39,33.59
N$3
  Bottom 0.152: 50.16,46.27 R3.1 | U1.7 52.87,45.09 | 62.23,43.49 CFG.1
  Bottom 0.406: 50.16,46.27 50.16,45.72 50.59,45.29 U1.7 53.77,45.29 55.24,43.81 55.88,43.81 57.78,41.91 61.59,41.91 62.23,42.55 62.23,43.49
N$4  (via drill 0.5)
  Top 1.016: R5.1 v37.47,36.2
  Bottom 0.152: 35.29,36.2 C2.1
  Bottom 0.61: v37.47,36.2 35.29,36.2
N$5  (via drill 0.5)
  Top 1.016: v37.47,33.66 R6.1
  Bottom 0.152: C3.1 35.92,32.43
  Bottom 0.406: 35.92,32.43 35.97,32.38 36.51,32.38 37.47,33.34 v37.47,33.66
N$6  (via drill 0.5)
  Top 0.305: PS1.23 42.84,30.16 v41.91,30.16
  Bottom 0.152: v41.91,30.16 41.86,30.11 | 40.69,30.11 40.64,30.16 40.32,29.84 C4.1
  Bottom 0.61: 41.86,30.11 40.69,30.11
N$7
  Bottom 0.406: IC3.16 44.13,18.41 45.91,20.19 SJ1.1
N$8  (via drill 0.5)
  Top 0.152: 17.13,15.86 v17.14,15.88
  Top 0.406: IC1.7 17.13,15.86
  Bottom 0.406: R16.2 v17.14,15.88 C15.1
N$9  (via drill 0.5)
  Top 0.305: PS1.24 44.02,29.73 43.81,29.53 v43.18,29.53
  Bottom 0.61: v43.18,29.53 43.5,29.89 C7.2
N$10
  Top 0.152: R14.1 36.98,23.03 | L2.2 42.34,21.13 42.52,20.95
  Top 0.61: 36.98,23.03 R4.2
  Top 1.27: 42.52,20.95 R4.2
N$11
  Top 0.406: IC1.6 17.79,15.25 18.1,15.56 22.23,15.56 24.77,13.02 29.21,13.02 29.84,12.38 SJ3.2
N$12
  Top 0.152: PS1.2 46.79,32.07 | R10.1 51.37,33.66
  Top 0.305: 46.79,32.07 50.8,32.07 51.5,32.77
  Top 0.406: 51.37,33.66 R11.2 | 51.5,32.77 R10.1
N$13  (via drill 0.5)
  Top 0.152: 19.99,9.53 R18.1 20.79,8.72
  Top 0.406: 19.99,9.53 17.78,9.53 v17.14,8.89 16.51,8.25 Q5.2 | Q6.3 20.79,9.04 20.64,8.89 20.79,8.72
  Bottom 0.61: R19.2 v17.14,8.89
N$14
  Bottom 0.152: 40.32,23.37 SJ12.1
  Bottom 0.406: IC3.15 41.9,19.06 40.32,20.64 40.32,23.37
N$15
  Top 0.305: PS1.19 41.66,33.09 39.69,31.11 R15.2
N$16  (via drill 0.5)
  Top 1.016: LED1.A v55.56,42.55 R12.1
  Bottom 0.406: R29.2 53.97,40.95 v55.56,42.55
N$17
  Bottom 0.152: 41.48,53.77 K1.28
  Bottom 0.305: 41.48,53.77 42.55,52.7 42.55,50.8 42.55,50.16
  Bottom 0.406: 42.55,50.16 45.92,46.79 R1.1 50.19,44.02 U1.6
N$18  (via drill 0.5)
  Top 1.016: LED2.A v55.56,40.64 R13.1
  Bottom 0.406: R28.2 55.88,40.32 v55.56,40.64
N$19
  Top 0.152: 20.07,11.54 C18.1
  Top 0.406: IC1.4 20.07,11.54
N$20  (via drill 0.5)
  Top 0.305: 41.27,31.75 v41.59,31.75 41.59,32.07 42.11,32.59 PS1.20 | PS1.13 44.02,36.72 44.45,37.15 v45.03,37.15
  Top 0.406: 41.27,31.75 36.83,27.3 R14.2
  Bottom 0.406: v45.03,37.15 44.45,37.15 41.59,34.35 v41.59,31.75
N$21
  Bottom 1.27: R19.1 PAD8.1 PAD17.1 R20.1
N$22  (via drill 0.5)
  Top 0.152: v17.13,10.17 17.14,10.16 | 14.56,10.16 C16.2
  Top 0.406: IC1.2 v17.13,10.17 | 17.14,10.16 14.56,10.16
  Bottom 0.152: R20.2 20.32,10.16 | 17.14,10.16 v17.13,10.17
  Bottom 0.406: 20.32,10.16 17.14,10.16
  Bottom 0.61: C17.1 R20.2
N$23
  Bottom 0.406: R2.1 41.59,48.26 41.39,48.38 41.39,50.16 48.8,42.75 U1.5
  Bottom 0.61: 41.39,50.16 K1.27
N$24
  Top 0.152: 14.61,12.7 13.92,12.7 C16.1
  Top 0.406: IC1.1 15.76,11.54 14.61,12.7 | R17.1 C16.1
N$25  (via drill 0.5)
  Top 0.152: Q5.1 | Q6.1 23.55,6.35
  Top 0.406: v22.23,7.3 22.23,6.35 R18.2 | R18.2 Q5.1 | 23.55,6.35 R18.2 | v22.23,10.16 21.91,10.48 18.11,10.46 17.79,10.78 IC1.3
  Bottom 0.406: v22.23,10.16 v22.23,7.3
N$26
  Top 0.406: IC2.5 56.2,13.66 56.52,13.97 SJ5.2
N$27  (via drill 0.35, 0.5)
  Top 0.406: IC2.4 56.2,13.01 v56.52,12.7
  Top 0.61: v63.5,13.97 SJ4.2
  Bottom 0.61: v56.52,12.7 62.23,12.7 v63.5,13.97
N$28
  Top 0.61: R22.1 SJ4.3
N$29
  Top 0.61: R23.1 SJ5.3
N$30
  Top 0.61: SJ7.1 R26.2
N$31
  Top 0.61: R27.2 SJ8.1
N$32  (via drill 0.5)
  Top 0.406: SJ9.2 7.3,37.47 v6.67,38.1
  Bottom 0.152: 7.58,38.73 IC4.8
  Bottom 0.406: v6.67,38.1 7.3,38.73 7.58,38.73
N$33  (via drill 0.5)
  Bottom 0.152: 8.26,38.75 IC4.7
  Bottom 0.406: SJ6.2 7.3,36.83 8.26,37.78 8.26,38.75
  other vias: 7.3,34.29
N$34
  Top 0.406: IC5.8 6.05,11.72 6.35,11.43 SJ8.2
N$35  (via drill 0.5)
  Top 0.152: IC5.7
  Top 0.406: IC5.7 4.13,12.38 v3.49,11.75
  Bottom 0.406: v3.49,11.75 4.45,11.75 6.35,9.84 SJ7.2
  other vias: 6.35,7.62
N$36
  Bottom 0.406: R37.1 SJ10.3
N$37  (via drill 0.75)
  Top 0.152: 28.69,41.49 v28.84,36.88 L3.1
  Top 0.813: IC7.2 28.69,41.49
  Bottom 0.152: 28.89,41.27 D2.C 28.89,40.32
  Bottom 1.27: v28.84,36.88 28.89,40.32
N$38  (via drill 0.5)
  Top 0.152: SJ6.1 v5.08,34.29
  Bottom 0.406: v5.08,34.29 R24.2
N$39  (via drill 0.5)
  Top 0.152: SJ9.1 5.4,36.51 v5.08,36.2
  Bottom 0.406: v5.08,36.2 R25.2
N$41
  Top 0.152: 25.4,32.84 IC7.4
  Top 0.406: R36.1 20.95,31.75 22.86,29.84 24.77,29.84 25.4,30.48 25.4,32.84
N$42
  Bottom 0.152: IC3.4 35.8,17.78
  Bottom 0.406: 35.8,17.78 SJ10.2
N$43  (via drill 0.5)
  Top 0.406: SJ11.2 32.7,17.78 v33.34,18.73
  Bottom 0.406: IC3.5 33.66,18.41 v33.34,18.73
  other vias: 29.21,17.78
N$44
  Bottom 0.406: R38.1 SJ11.3
PIN
  Top 0.152: 51.12,28.89 51.06,28.95 Q2.2 | Q1.2 50.7,46.99 | 58.42,43.18 R12.2 | C14.+ 58.42,37.47
  Top 0.305: PS1.27 45.52,30.05 45.72,29.84
  Top 0.61: 45.72,29.84 51.12,29.84
  Top 0.813: 51.12,28.89 51.12,29.84 54.29,29.84 57.47,33.02 57.47,35.24 58.42,36.2 58.42,37.47 R13.2 R12.2 | 58.42,43.18 54.61,46.99 50.7,46.99
RG1
  Top 0.152: R8.2 46.02,38.08
  Top 0.305: PS1.9 46.02,38.08
RG2
  Top 0.305: PS1.14 43.52,37.76 42.86,38.42 R9.2
SCL  (via drill 0.5)
  Top 0.152: 5.39,13.65 IC5.5 | IC2.9 48.51,15.56
  Top 0.406: v3.81,14.92 3.81,14.29 4.45,13.65 5.39,13.65 | 48.51,15.56 v46.99,15.56
  Bottom 0.152: 35.82,14.98 35.88,14.92
  Bottom 0.406: K1.5 13.45,49.96 12.06,48.26 12.06,41.27 11.75,40.95 IC4.5 9.55,32.09 8.89,31.43 8.89,26.35 3.49,20.95 3.49,20.32 | 3.49,20.32 3.49,15.24 v3.81,14.92 | v46.99,15.56 46.35,14.92 35.88,14.92 35.88,11.11 34.61,9.84 29.21,9.84 18.73,20.32 3.49,20.32 | IC3.1 35.82,14.98
SDA  (via drill 0.5)
  Top 0.152: 38.49,13.09 v38.42,13.02 | 52.44,15.61 v52.39,15.56
  Top 0.406: v5.08,18.73 v1.91,18.73 | v38.49,15.8 38.49,13.09 | IC2.8 52.44,15.61 | IC5.6 3.8,13.03 v1.91,14.92
  Bottom 0.152: IC4.6 | 38.47,15.82 v38.49,15.8
  Bottom 0.406: K1.3 11.23,50.48 11.23,41.39 9.84,40.01 9.21,40.01 8.89,39.69 IC4.6 | IC4.6 8.9,33.66 7.3,32.07 7.3,26.67 1.91,21.27 v1.91,18.73 v1.91,14.92 | v5.08,18.73 18.41,18.73 28.89,8.26 34.92,8.26 38.42,11.75 | IC3.2 38.16,16.46 38.47,16.14 38.47,15.82 | 38.42,11.75 v38.42,13.02 | v52.39,15.56 48.58,11.75 38.42,11.75
SHDN  (via drill 0.5)
  Top 0.152: PS1.8 46.75,35.1
  Top 0.305: 46.75,35.1 46.85,35.1 46.99,35.24 46.99,36.2 v47.07,36.2
  Top 0.406: v38.42,23.5 v38.42,27.62
  Bottom 0.152: R40.2 44.45,40.64
  Bottom 0.406: 47.07,37.07 v47.07,36.2 47.07,38.97 45.4,40.64 44.45,40.64 42.86,40.64 39.69,37.47 39.69,32.7 37.78,30.8 37.78,28.26 v38.42,27.62
  Bottom 1.016: SJ12.2 v38.42,23.5
SW  (via drill 0.75)
  Top 0.152: 47.62,27.33 48.23,27.33 48.26,27.3 | 47.62,27.33 D1.C 47.35,27.33 | 44.45,27.37 44.45,27.33 44.52,27.4 v44.7,28.03 | 47.56,27.4 47.62,27.33 | 45.02,27.87 44.77,27.62 | 42.18,27.4 L2.1
  Top 0.305: PS1.25 44.52,27.4 | v44.7,28.03 44.7,27.55 44.77,27.62 45.09,27.94 | PS1.26 45.02,27.87
  Top 1.27: 47.35,27.33 44.45,27.33 | 44.52,27.4 42.18,27.4
  Bottom 0.152: C7.1 44.81,27.6 v44.7,28.03
SYS  (via drill 0.75)
  Top 0.152: 30.39,36.42 v30.48,36.51 | Q3.2 37.56,38.42 | 42.55,40.32 R7.1
  Top 1.016: IC7.1 30.39,36.42 | 42.55,40.32 v39.15,40.32 39.15,38.51 38.42,38.42
  Top 1.27: 37.56,38.42 38.42,38.42 R9.1
  Bottom 0.152: 39.05,40.32 | C11.+ 33.02,40.32 | C12.+ 36.51,39.69 36.83,39.37 37.78,40.32 39.05,40.32 | 39.05,40.32 v39.15,40.32
  Bottom 0.813: v39.15,40.32 39.37,40.55
  Bottom 1.016: 33.02,40.32 32.07,39.69
  Bottom 1.27: v30.48,36.51 30.48,38.1 32.07,39.69 | 33.02,40.32 39.05,40.32 | 39.37,40.55 C34.1
VCC  (via drill 0.5)
  Top 0.152: Q1.3 43.43,44.83 44.77,43.5 | 45.08,40.32 R7.2 | 42.23,37.27 v42.23,37.47
  Top 0.305: PS1.15 42.77,36.73 42.23,37.27
  Top 1.016: R8.1 45.08,40.32 | R7.2 v44.77,39.05
  Top 1.27: 44.77,43.5 R7.2
  Bottom 0.813: v42.23,37.47 43.81,39.05 v44.77,39.05
VIN  (via drill 0.5, 0.75)
  Top 0.152: IC2.15 48.26,11.7 | 44.39,12.01 44.45,12.06 44.13,12.38 | PS1.28 46.06,30.8 | Q3.1 33,38.42 | 44.16,16.17 44.45,15.88 | PAD12.1 PAD11.1 | C8.1 46.67,18.73 46.99,18.41
  Top 0.305: 46.06,30.8 v48.9,30.8
  Top 0.406: IC2.14 44.79,12.36 44.45,12.7 | IC2.15 44.8,11.71 44.45,12.06 | IC2.16 44.82,11.06 44.45,11.43 | 33,38.42 33.02,38.1 32.7,37.78
  Top 0.813: v50.48,25.72 50.48,20.95 Q2.3
  Top 1.016: 32.7,37.78 v32.7,36.83
  Top 1.27: Q2.3 49.57,21 46.99,18.41 44.45,15.88 44.45,12.7 44.45,12.06 44.45,11.43 PAD11.1 | C13.+ 44.16,16.17
  Bottom 0.61: v48.9,30.8 48.9,26.99 50.16,25.72
  Bottom 0.813: 50.16,25.72 v50.48,25.72
  Bottom 1.016: v32.7,36.83 32.7,29.84 36.83,25.72 v50.48,25.72
VOUT  (via drill 0.75)
  Top 0.152: 15.99,39.09 R35.2 | 15.88,38.53 15.99,38.42 | 20,42.23 L3.2 19.37,42.12
  Top 0.406: IC6.1 17.69,36.6 17.14,37.15 15.99,37.15 | R36.2 20.95,35.56 19.37,37.15 19.37,42.12
  Top 0.813: 15.99,39.09 15.99,38.42 15.99,37.15 IC6.2
  Top 1.27: v23.18,41.27 21.91,42.23 20,42.23 | L3.2 17.14,42.23 15.88,40.96 15.88,38.53
  Bottom 0.152: 22.86,41.88 23.18,41.57
  Bottom 1.27: v23.18,41.27 23.18,41.57 | 23.18,41.57 23.18,41.59 C24.+ | 23.18,41.57 C24.+ | 23.18,41.57 C23.+ C31.+ 25.08,36.24 C25.1 | C30.+ C24.+
VOUT_REG  (via drill 0.5, 0.75)
  Top 0.152: 12.7,33.06 IC6.4 | 12.7,42.06 R35.1 | 12.84,44.27 12.87,44.24 | 12.87,44.24 13.03,44.4 | 12.87,44.24 10.21,44.24 R32.2
  Top 0.406: v6.67,41.91 8.89,41.91 9.99,43.01 R32.2
  Top 0.813: 12.7,33.06 R33.1 12.7,42.06
  Top 1.016: R35.1 12.87,44.24
  Top 1.27: v15.24,44.45 15.19,44.4 13.03,44.4 | R32.2 12.65,44.45
  Bottom 0.152: C28.1 12.16,38.05
  Bottom 0.406: IC4.1 6.96,41.25 v6.67,41.91
  Bottom 0.813: 12.16,38.05 C32.+
  Bottom 1.016: C26.+ 15.24,41.91 v15.24,44.45 15.29,44.45
  Bottom 1.27: C32.+ C26.+ C27.+ C33.+
VREF33
  Top 0.152: R10.2 | 51.37,35.56 R10.2 | R10.2 51.12,35.49
  Top 0.305: PS1.5 47.88,33.59 49.21,34.92 51.12,34.92 51.12,35.49 51.12,35.56
  Top 0.406: C9.1 51.31,35.43 51.44,35.56 R10.2

### Text on the board
Top: TOP
Bottom: BOTTOM
tNames: DC OK | Charging | +5V | 12V Bat | 12V Load | Power Board | Batt 1 | Batt 2 | Rev 1.0 / AGW Dec 2017 | IO-A6